# EAGLE design 超音波センサ中継回路 (EAGLE 6.4)
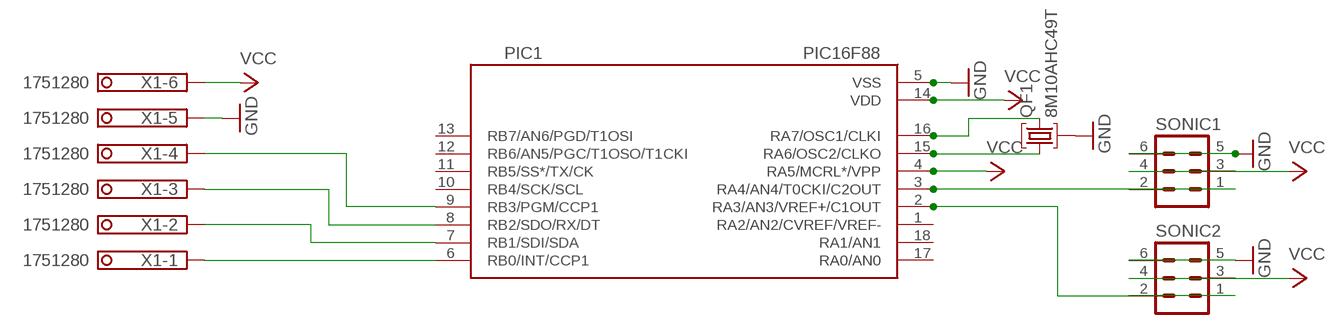
[diagram p0: schematic, sheet 1]

## Parts
PIC1  PIC16F88  [DIL18]
QF1  8M10AHC49T  [HC49U]
SONIC1  ML6  [ML6]
SONIC2  ML6  [ML6]
X1  1751280  [1751280]

## Nets
GND: PIC1.5(VSS) QF1.2 SONIC1.5 SONIC1.6 SONIC2.5 SONIC2.6 X1.5
N$1: PIC1.9(RB3/PGM/CCP1) X1.4
N$2: PIC1.6(RB0/INT/CCP1) X1.1
N$3: PIC1.2(RA3/AN3/VREF+/C1OUT) SONIC2.1 SONIC2.2
N$4: PIC1.7(RB1/SDI/SDA) X1.2
N$5: PIC1.3(RA4/AN4/T0CKI/C2OUT) SONIC1.1 SONIC1.2
N$6: PIC1.8(RB2/SDO/RX/DT) X1.3
N$11: PIC1.15(RA6/OSC2/CLKO) QF1.1
N$12: PIC1.16(RA7/OSC1/CLKI) QF1.3
VCC: PIC1.4(RA5/MCRL*/VPP) PIC1.14(VDD) SONIC1.3 SONIC1.4 SONIC2.3 SONIC2.4 X1.6
Unconnected: PIC1.1(RA2/AN2/CVREF/VREF-) PIC1.10(RB4/SCK/SCL) PIC1.11(RB5/SS*/TX/CK) PIC1.12(RB6/AN5/PGC/T1OSO/T1CKI) PIC1.13(RB7/AN6/PGD/T1OSI) PIC1.17(RA0/AN0) PIC1.18(RA1/AN1)

## Library data of the parts
PIC1 = pic16f88-v0.1:PIC16F88
QF1 = crystal:8M10AHC49T: Monolithic Crystal Filters Source: www.vanlong.com; OC_FARNELL: unknown; OC_NEWARK: unknown
SONIC1 SONIC2 = con-harting-ml:ML6: HARTING; OC_FARNELL: unknown; OC_NEWARK: unknown
X1 = con-phoenix-350:1751280: MKDS 1/ 6-3,5 Printklemme Nennstrom: 10 A Bemessungsspannung: 160 V Raster: 3,5 mm Polzahl: 6 Montageart: Löten Anschlussart: Schraubanschluss Anschlussrichtung vom Leiter zur Platine: 0° Source: http://eshop.phoenixcontact.com .. 1751280.pdf; MPN: 1751280; OC_FARNELL: unknown; OC_NEWARK: 27R1765

## Board
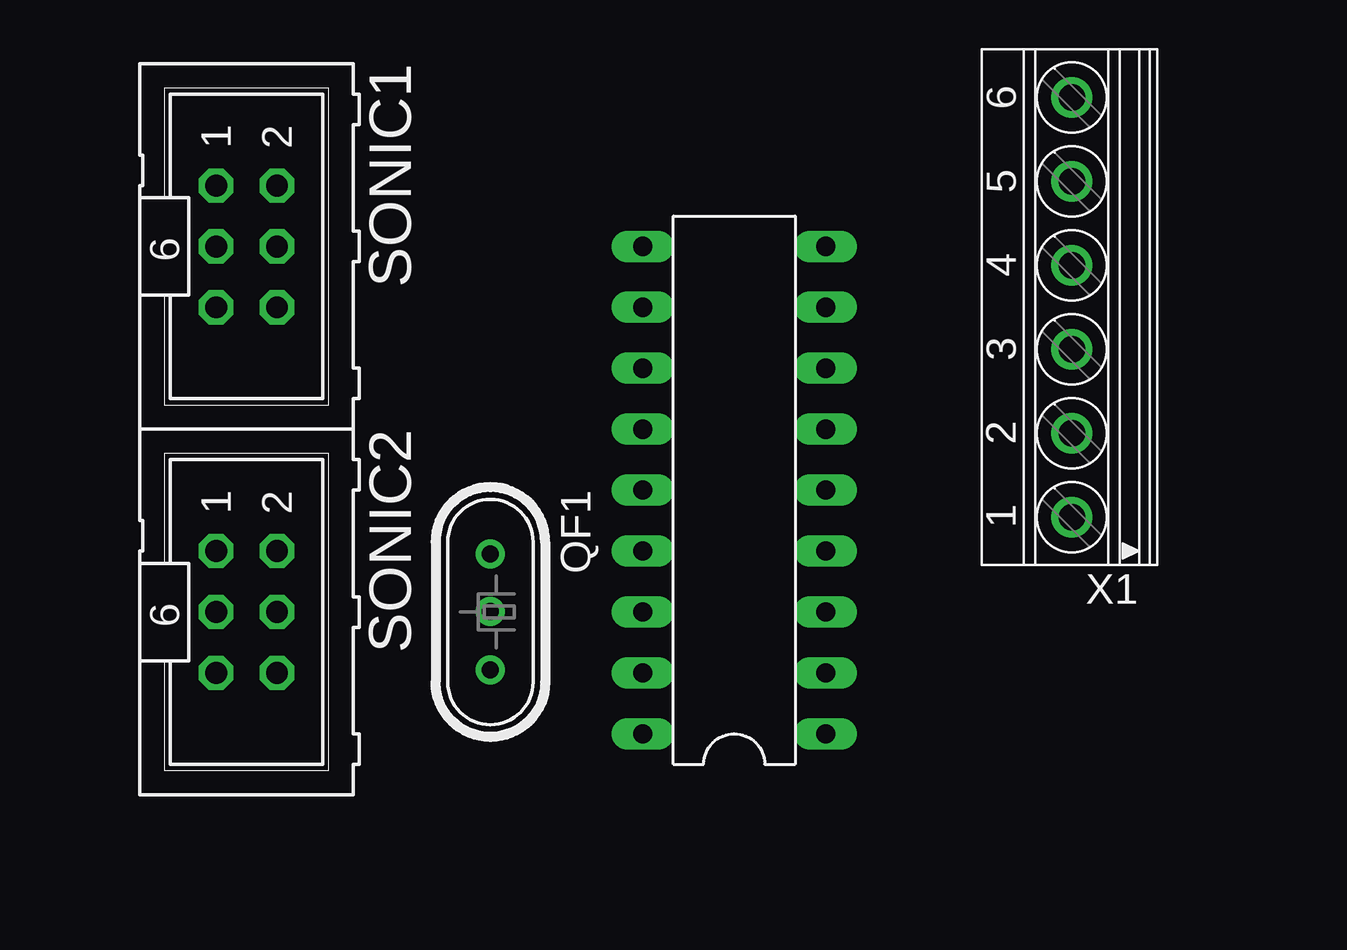
[diagram p1: board, top side]
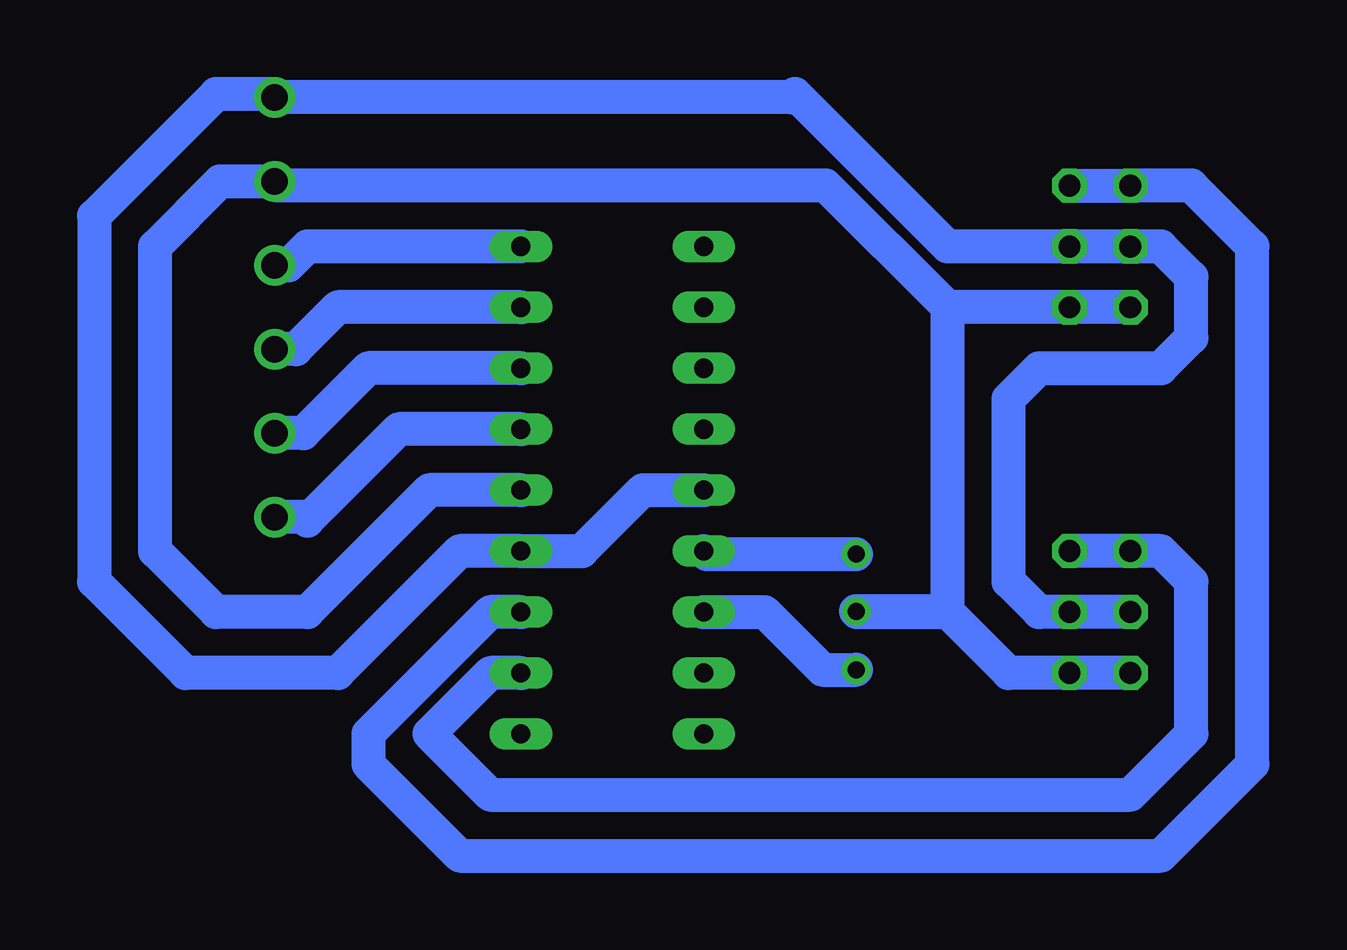
[diagram p2: board, bottom side, seen from below]

No outline drawn. Coordinates in mm, seen from the top.
Copper layers (1*16): Top 0.035mm / dielectric 1.5mm / Bottom 0.035mm
Design rules "default *": minimum track width 20mil, minimum drill 24mil, track to track 8mil, track to pad 8mil, pad to pad 8mil, via to via 8mil, smd to smd 8mil, copper to edge 20mil, drill to drill 20mil, minimum pad ring 10mil, minimum via ring 8mil, stop-mask expansion 8mil, vias tented up to drill 0mil, thermal gap 20mil

### Footprints (pad centres in the part's own frame; a part is rotated, then mirrored left to right if it is on the bottom)
DIL18 = drill 0.8 long: 1 -15.24,0; 2 -12.7,0; 3 -10.16,0; 4 -7.62,0; 5 -5.08,0; 6 -2.54,0; 7 0,0; 8 2.54,0; 9 5.08,0; 10 5.08,7.62; 11 2.54,7.62; 12 0,7.62; 13 -2.54,7.62; 14 -5.08,7.62; 15 -7.62,7.62; 16 -10.16,7.62; 17 -12.7,7.62; 18 -15.24,7.62
HC49U = drill 0.7 pad 1.2: 1 -2.413,0; 2 -0.027,0; 3 2.413,0
ML6 = drill 0.914 octagon: 1 -2.54,-1.27; 2 -2.54,1.27; 3 0,-1.27; 4 0,1.27; 5 2.54,-1.27; 6 2.54,1.27
1751280 = drill 1.1 pad 1.7: 1 -8.75,-0.1; 2 -5.25,-0.1; 3 -1.75,-0.1; 4 1.75,-0.1; 5 5.25,-0.1; 6 8.75,-0.1

### Placement (x,y rotation side)
PIC1  33.02,22.86 90 top
QF1  19.05,12.7 270 top
SONIC1  8.89,27.94 270 top
SONIC2  8.89,12.7 270 top
X1  43.18,25.4 90 top

### Tracks (layer width: path | path; a pad name or v marks a point on that pad's centre or on a via)
GND
  Bottom 1.422: SONIC2.5 SONIC2.6 12.7,10.16 15.24,12.7 | SONIC1.5 SONIC1.6 15.24,25.4 | 15.24,12.7 15.27,12.73 | 15.27,12.73 QF1.2 19.02,12.7 15.24,12.7 | 15.27,12.73 15.24,12.75 | 15.24,12.75 15.24,25.4 | 15.24,12.7 15.24,12.75 | PIC1.5 36.83,17.78 41.91,12.7 45.72,12.7 48.26,15.24 48.26,27.94 45.55,30.65 X1.5 43.28,30.58 43.18,30.48 20.32,30.48 15.24,25.4
N$1
  Bottom 1.422: PIC1.9 41.91,27.94 42.7,27.15 X1.4
N$2
  Bottom 1.422: PIC1.6 38.1,20.32 41.91,16.51 42.05,16.65 X1.1
N$3
  Bottom 1.422: PIC1.2 34.29,10.16 36.83,7.62 34.29,5.08 7.62,5.08 5.08,7.62 5.08,13.97 6.35,15.24 SONIC2.1 SONIC2.2
N$4
  Bottom 1.422: PIC1.7 39.37,22.86 42.08,20.15 X1.2
N$5
  Bottom 1.422: SONIC1.2 SONIC1.1 5.08,30.48 2.54,27.94 2.54,6.35 6.35,2.54 35.56,2.54 39.37,6.35 39.37,7.62 34.29,12.7 PIC1.3
N$6
  Bottom 1.422: PIC1.8 40.64,25.4 42.39,23.65 X1.3
N$11
  Bottom 1.422: PIC1.15 25.27,15.11 QF1.1
N$12
  Bottom 1.422: PIC1.16 22.86,12.7 20.45,10.29 QF1.3
VCC
  Bottom 1.422: SONIC2.3 SONIC2.4 11.43,12.7 12.7,13.97 12.7,21.59 11.43,22.86 6.35,22.86 5.08,24.13 5.08,26.67 6.35,27.94 SONIC1.3 SONIC1.4 15.24,27.94 21.59,34.29 21.73,34.15 X1.6 43.42,34.29 45.72,34.29 50.8,29.21 50.8,13.97 46.99,10.16 40.64,10.16 35.56,15.24 PIC1.4 30.48,15.24 27.94,17.78 PIC1.14